# EasyEDA Pro project AmpBoard64SMD.eprj, board Mod16Top
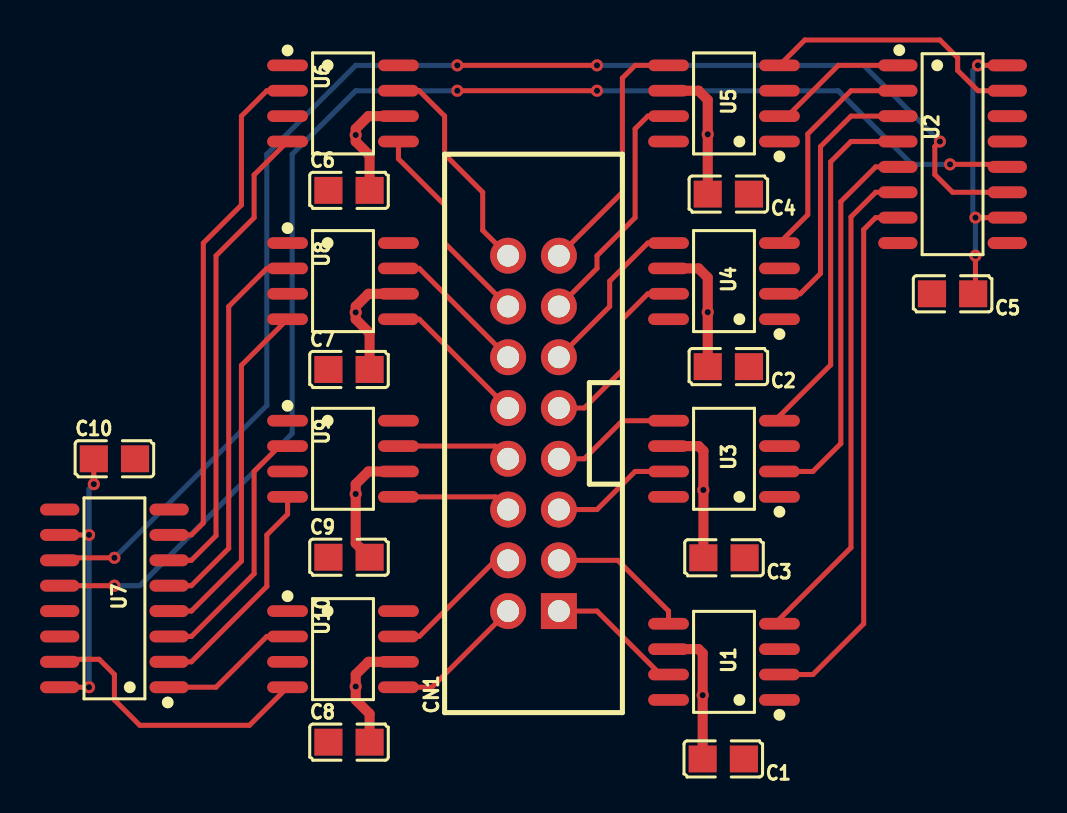
[diagram p5: board, top side]
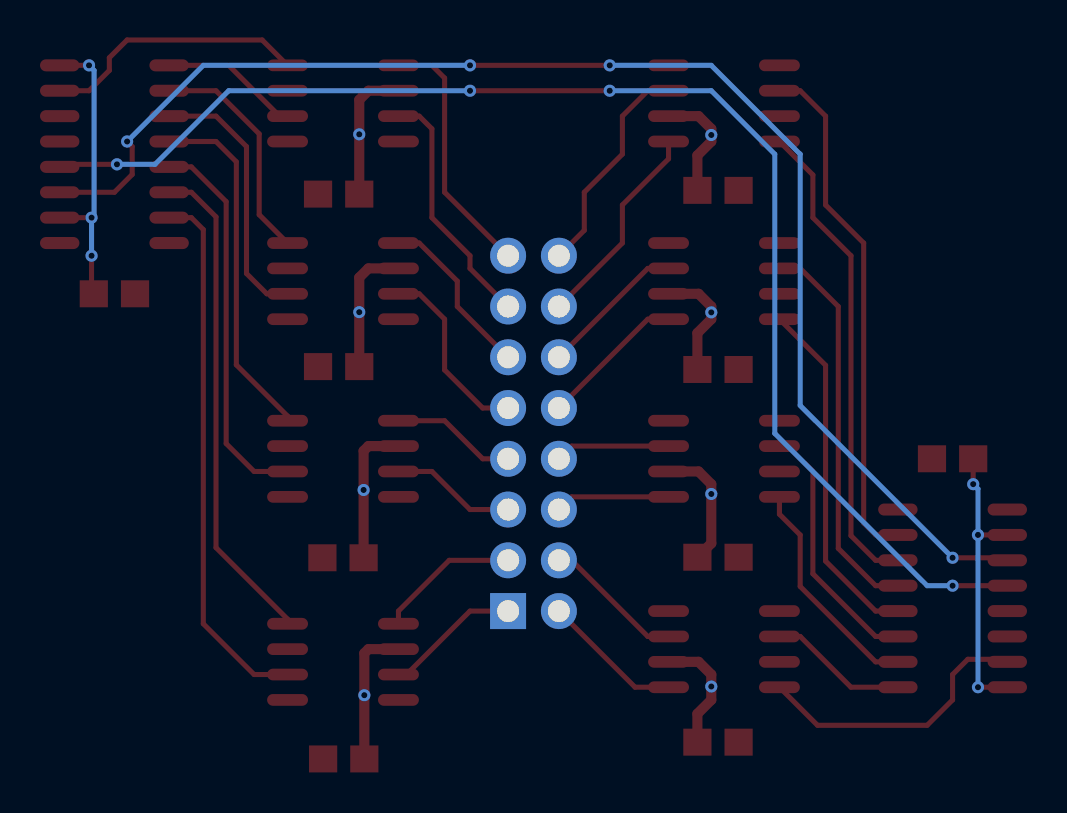
[diagram p6: board, bottom side, seen from below]

No outline. copper layers: Top Layer, Inner1, Inner2, Bottom Layer. Coordinates in mm from the lowest, leftmost part position.
Stack: Top Layer 0.035mm 外层铜厚1oz / Dielectric1 0.2104mm 7628 RC49% 8.6mil / Inner1 0.0152mm 内层铜厚 / Dielectric2 1.065mm 1.1mm H/HOZ 含铜 / Inner2 0.0152mm 内层铜厚 / Dielectric3 0.2104mm 7628 RC49% 8.6mil / Bottom Layer 0.035mm 外层铜厚1oz

## Design rules (mm)
template: JLCPCB Capability(Two Layers Board)
spacing copperThickness1oz (default): track to track 0.102, other pairs 0.152 to 0.3
spacing copperThickness2oz: track to track 0.203, other pairs 0.152 to 0.3
track width copperThickness1oz (default): min 0.127, default 0.254, max 2.54
track width copperThickness2oz: min 0.203, default 0.254, max 2.54
differential pair differentialPair (default): width min 0.127, default 0.254, max 2.54; gap min 0.152, default 0.152
via viaSize (default): diameter min 0.5, default 0.61, max 10; hole min 0.3, default 0.305, max 6.3

## Placement (name value [footprint] x y rotation side)
C1  100pF  [C0805]  30.44 0 180 top
C2  100pF  [C0805]  30.7 19.63 180 top
C3  100pF  [C0805]  30.48 10.06 180 top
C4  100pF  [C0805]  30.7 28.26 180 top
C5  100pF  [C0805]  41.91 23.27 180 top
C6  100pF  [C0805]  11.73 28.45 0 top
C7  100pF  [C0805]  11.73 19.49 0 top
C8  100pF  [C0805]  11.73 0.84 0 top
C9  100pF  [C0805]  11.73 10.09 0 top
C10  100pF  [C0805]  0 15.02 0 top
CN1  KH-2.54PH180-2X8P-L8.9  [CONN-TH_16P-P2.54_KINGHELM_KH-2.54PH180-2X8P-L8.9]  20.95 16.29 90 top
U1  IXDN602SIATR  [SOIC-8_L4.9-W3.9-P1.27-LS6.0-BL]  30.48 4.86 90 top
U2  74HC595D,118  [SOIC-16_L9.9-W3.9-P1.27-LS6.0-BL]  41.91 30.26 270 top
U3  IXDN602SIATR  [SOIC-8_L4.9-W3.9-P1.27-LS6.0-BL]  30.48 15.02 90 top
U4  IXDN602SIATR  [SOIC-8_L4.9-W3.9-P1.27-LS6.0-BL]  30.48 23.91 90 top
U5  IXDN602SIATR  [SOIC-8_L4.9-W3.9-P1.27-LS6.0-BL]  30.48 32.8 90 top
U6  IXDN602SIATR  [SOIC-8_L4.9-W3.9-P1.27-LS6.0-BL]  11.43 32.8 270 top
U7  74HC595D,118  [SOIC-16_L9.9-W3.9-P1.27-LS6.0-BL]  0 8.03 90 top
U8  IXDN602SIATR  [SOIC-8_L4.9-W3.9-P1.27-LS6.0-BL]  11.43 23.91 270 top
U9  IXDN602SIATR  [SOIC-8_L4.9-W3.9-P1.27-LS6.0-BL]  11.43 15.02 270 top
U10  IXDN602SIATR  [SOIC-8_L4.9-W3.9-P1.27-LS6.0-BL]  11.43 5.49 270 top

## Footprints (pads in the part's own frame, mm; a bottom-side part is the same pattern mirrored in y, then rotated)
C0805
  rect 1.41x1.35 smd: 1(-1.03,0) 2(1.03,0)
CONN-TH_16P-P2.54_KINGHELM_KH-2.54PH180-2X8P-L8.9
  rect 1.8x1.8 hole 1.1: 1(-8.89,-1.27)
  round 1.8 hole 1.1: 2(-8.89,1.27) 3(-6.35,-1.27) 4(-6.35,1.27) 5(-3.81,-1.27) 6(-3.81,1.27) 7(-1.27,-1.27) 8(-1.27,1.27) 9(1.27,-1.27) 10(1.27,1.27) 11(3.81,-1.27) 12(3.81,1.27) 13(6.35,-1.27) 14(6.35,1.27) 15(8.89,-1.27) 16(8.89,1.27)
SOIC-8_L4.9-W3.9-P1.27-LS6.0-BL
  oval 0.588x2.045 smd: 1(-1.905,-2.772) 2(-0.635,-2.772) 3(0.635,-2.772) 4(1.905,-2.772) 5(1.905,2.772) 6(0.635,2.772) 7(-0.635,2.772) 8(-1.905,2.772)
SOIC-16_L9.9-W3.9-P1.27-LS6.0-BL
  oval 0.602x1.971 smd: 1(-4.445,-2.736) 2(-3.175,-2.736) 3(-1.905,-2.736) 4(-0.635,-2.736) 5(0.635,-2.736) 6(1.905,-2.736) 7(3.175,-2.736) 8(4.445,-2.736) 9(4.445,2.736) 10(3.175,2.736) 11(1.905,2.736) 12(0.635,2.736) 13(-0.635,2.736) 14(-1.905,2.736) 15(-3.175,2.736) 16(-4.445,2.736)

## Nets
As in the schematic.

Pads without a net: U1 1 8; U2 9; U3 1 8; U4 1 8; U5 1 8; U6 1 8; U7 9; U8 1 8; U9 1 8; U10 1 8

## Via types
v1: diameter 0.61, hole 0.305, Top Layer to Bottom Layer, 22 vias

## Routing (per net, layer and track width the routed paths; a pad name or vN(x,y) marks a point on that pad's centre or on a via; arc(x,y) is an arc through that point)
+5V: length 29.2
  Top Layer w0.254: C5.1 43.05,23.39 v1(43.05,25.18) ; v1(-1.27,11.21) U7.10 ; v1(43.05,27.08) U2.10 ; C10.1 v1(-1.03,13.75) ; v1(43.18,34.7) U2.16 ; v1(-1.27,3.59) U7.16
  Bottom Layer w0.254: v1(43.18,34.7) 42.93,34.45 42.93,27.21 v1(43.05,27.08) v1(43.05,25.18) ; v1(-1.27,3.59) v1(-1.27,11.21) -1.27,13.51 v1(-1.03,13.75)
VCC: length 51.8
  Top Layer w0.508: U6.6 12.7,32.16 12.06,31.53 v1(12.06,31.22) 12.06,30.89 12.76,30.2 C6.2 ; U4.6 29.21,24.54 29.67,24.09 v1(29.67,22.35) C2.2 ; C3.2 v1(29.45,13.46) 29.45,15.41 29.21,15.65 U3.6 ; C7.2 12.76,21.31 12.06,22 12.06,22.64 12.7,23.27 U8.6 ; C9.2 12.06,10.79 v1(12.06,13.26) 12.06,13.75 12.7,14.38 U9.6 ; U5.6 29.21,33.43 29.67,32.98 v1(29.67,31.25) C4.2 ; C1.2 v1(29.41,3.19) 29.41,5.29 29.21,5.49 U1.6 ; U10.6 12.7,4.86 12.06,4.22 v1(12.06,3.62) 12.06,2.95 12.76,2.26 C8.2
  vias: v1(12.06,22.34)
CLOCK: length 69
  Top Layer w0.254: v1(0,10.06) -2.61,10.06 U7.11 ; v1(24.13,34.7) v1(17.14,34.7) ; U2.11 41.91,28.35 41.02,29.24 41.02,30.64 v1(41.28,30.89)
  Bottom Layer w0.254: v1(24.13,34.7) 37.47,34.7 v1(41.28,30.89) ; v1(17.14,34.7) 12.06,34.7 7.62,30.26 7.62,17.69 v1(0,10.06)
LATCH: length 67.4
  Top Layer w0.254: v1(41.78,29.75) 44.52,29.75 44.65,29.62 ; v1(0,8.67) U7.12 ; v1(17.14,33.43) v1(24.13,33.43)
  Bottom Layer w0.254: v1(24.13,33.43) 36.19,33.43 39.88,29.75 v1(41.78,29.75) ; v1(0,8.67) 1.27,8.67 8.89,16.29 8.89,30.26 12.06,33.43 v1(17.14,33.43)
$1N942: length 6.8
  Top Layer w0.254: U1.7 27.31,4.22 24.13,7.4 CN1.1
$1N946: length 7.2
  Top Layer w0.254: U1.5 27.71,7.4 25.17,9.94 CN1.3
$1N951: length 6.3
  Top Layer w0.254: CN1.5 24.13,12.48 26.03,14.38 U3.7
$1N956: length 6.3
  Top Layer w0.254: CN1.7 23.5,15.02 25.4,16.92 U3.5
$1N961: length 9.3
  Top Layer w0.254: CN1.9 23.5,17.56 25.4,19.46 25.4,22 26.67,23.27 U4.7
$1N970: length 8.6
  Top Layer w0.254: U4.5 26.67,25.81 24.76,23.91 24.76,22.64 CN1.11
$1N975: length 12.4
  Top Layer w0.254: CN1.13 24.13,24.54 24.13,25.18 26.03,27.08 26.03,31.53 26.67,32.16 U5.7
$1N980: length 12.8
  Top Layer w0.254: U5.5 26.03,34.7 25.4,34.07 25.4,28.35 CN1.15
$1N1841: length 11.1
  Top Layer w0.254: 19.69,25.18 18.41,26.45 18.41,28.35 16.51,30.26 16.51,32.16 15.24,33.43 U6.7
$1N1844: length 10.5
  Top Layer w0.254: 19.69,22.64 16.51,25.81 16.51,27.72 14.2,30.03 U6.5
$1N1848: length 7.3
  Top Layer w0.254: 19.69,20.1 15.24,24.54 U8.7
$1N1852: length 7.3
  Top Layer w0.254: 19.69,17.56 15.24,22 U8.5
$1N1856: length 5.7
  Top Layer w0.254: U9.7 19.05,15.65 19.69,15.02
$1N1860: length 5.7
  Top Layer w0.254: 19.69,12.48 19.05,13.11 U9.5
$1N1864: length 7.1
  Top Layer w0.254: 19.69,9.94 19.05,9.94 15.24,6.13 U10.7
$1N1868: length 7.1
  Top Layer w0.254: U10.5 15.88,3.59 19.69,7.4
$1N2749: length 13.3
  Top Layer w0.254: U5.4 34.52,35.97 41.28,35.97 42.16,35.08 42.16,34.45 43.18,33.43 U2.15
$1N2754: length 7
  Top Layer w0.254: U5.2 33.66,32.16 36.19,34.7 U2.1
$1N2758: length 11.4
  Top Layer w0.254: U2.2 36.83,33.43 34.67,31.27 34.67,27.23 U4.4
$1N2763: length 13.3
  Top Layer w0.254: U4.2 34.29,23.27 35.31,24.29 35.31,30.64 36.83,32.16 U2.3
$1N2768: length 17.8
  Top Layer w0.254: U3.4 33.25,17.16 35.81,19.72 35.81,29.88 36.83,30.89 U2.4
$1N2773: length 19.3
  Top Layer w0.254: U3.2 34.92,14.38 36.32,15.78 36.32,27.88 38.06,29.62 39.17,29.62
$1N2778: length 24.7
  Top Layer w0.254: U2.6 38.06,28.35 36.83,27.12 36.83,10.57 33.25,7 U1.4
$1N2783: length 26.9
  Top Layer w0.254: U2.7 38.06,27.08 37.47,26.49 37.47,6.76 34.92,4.22 U1.2
$1N2803: length 14.3
  Top Layer w0.254: U7.15 -2.61,4.99 -0.76,4.99 0,4.22 0,2.95 1.27,1.68 6.75,1.68 U10.4
$1N2813: length 7
  Top Layer w0.254: U10.2 7.62,6.13 5.08,3.59 U7.1
$1N2823: length 11.4
  Top Layer w0.254: U7.2 3.85,4.86 7.62,8.63 7.62,11.21 8.66,12.25 U9.4
$1N2835: length 12.9
  Top Layer w0.254: U9.2 8.25,15.65 6.98,14.38 6.98,9.27 3.85,6.13 U7.3
$1N2845: length 17.7
  Top Layer w0.254: U8.4 6.35,19.7 6.35,9.9 3.85,7.4 U7.4
$1N2857: length 19.6
  Top Layer w0.254: U7.5 3.85,8.67 5.72,10.53 5.72,22.64 7.62,24.54 U8.2
$1N2869: length 24.1
  Top Layer w0.254: U7.6 3.85,9.94 5.08,11.17 5.08,25.18 6.98,27.08 6.98,29.22 U6.4
$1N2881: length 25.9
  Top Layer w0.254: U7.7 3.85,11.21 4.44,11.81 4.44,25.81 6.35,27.72 6.35,32.16 7.62,33.43 U6.2
